# Altium schematic sheet Sheet2.SchDoc
size 420 x 297 mm; Address1: Address1; Address2: Address2; Address3: Address3; Address4: Address4; DocumentNumber: АБВГ.123456.001 Э3; SheetNumber: 1; Scale: 1:1; DocumentType: Схема электрическая принципиальная; FirstReferrence: АБВГ.123456.001
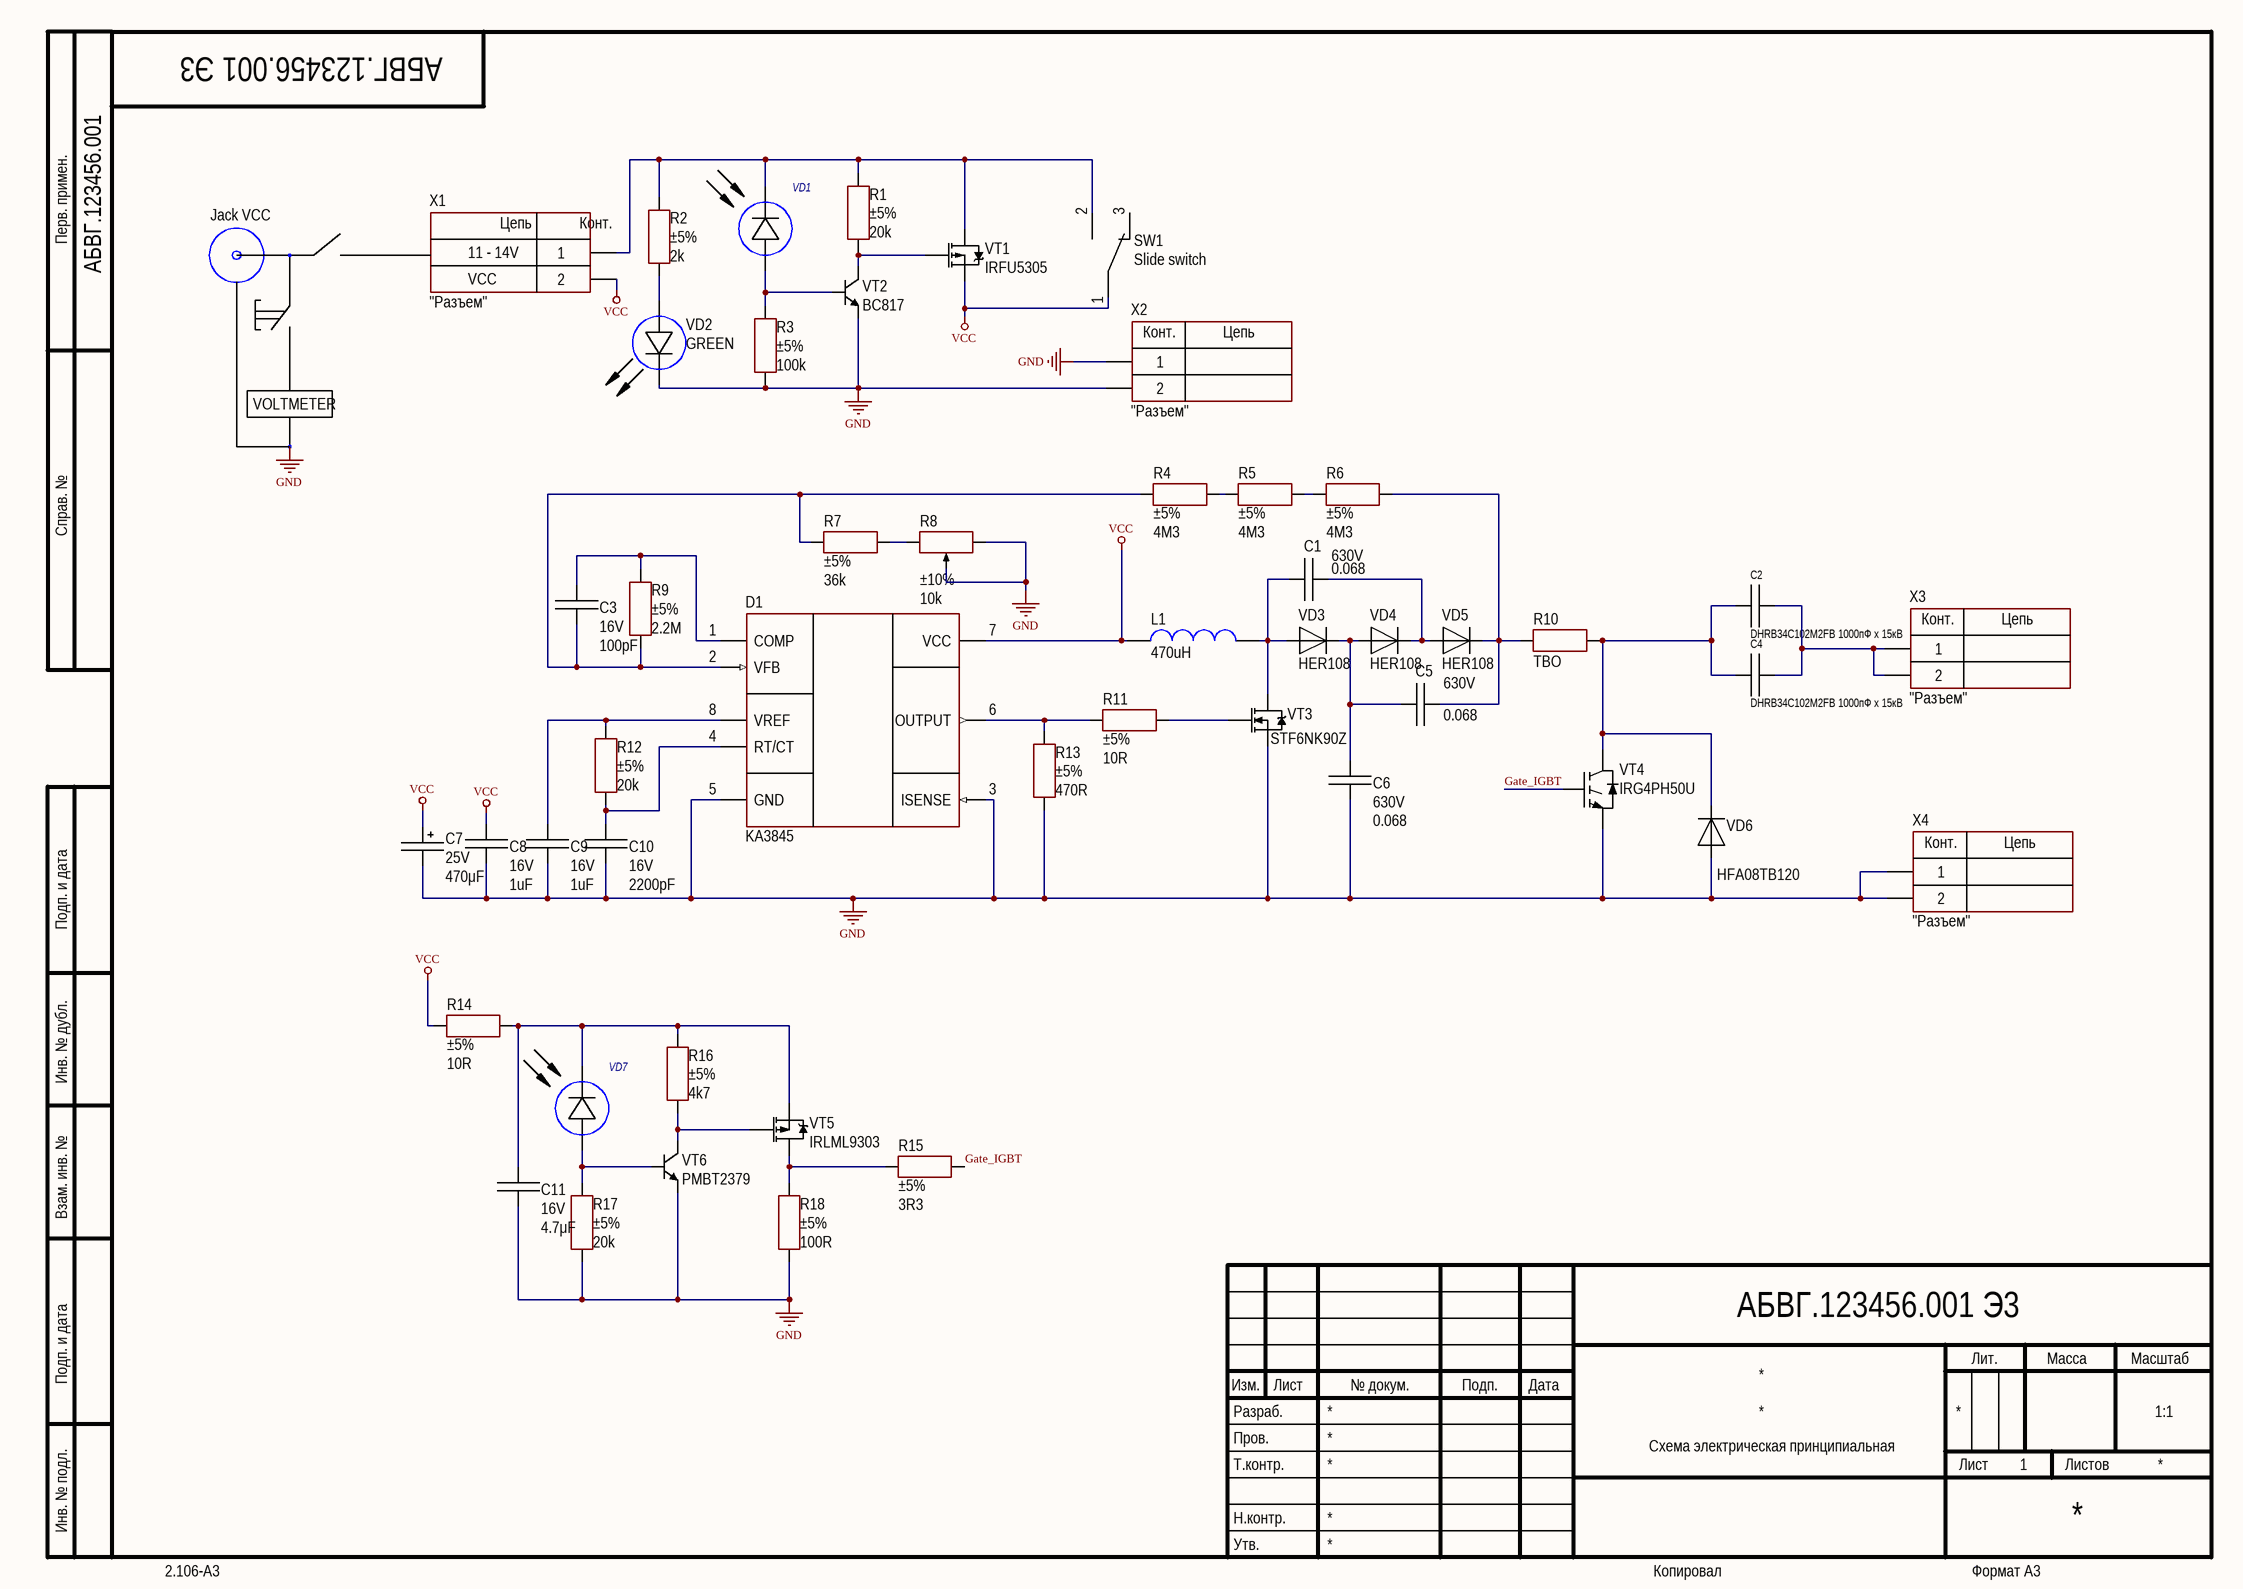
[diagram p0: Sheet2.SchDoc]

## Parts
C1  value 0.068  Voltage: 630V  [CAP: 1812]
C2  DHRB34C102M2FB 1000пФ х 15кВ  [CAP: HV_CYL_METALL-PAPER_CAP]
C3  value 100pF  Voltage: 16V  [CAP: 0805]
C4  DHRB34C102M2FB 1000пФ х 15кВ  [CAP: HV_CYL_METALL-PAPER_CAP]
C5  value 0.068  Voltage: 630V  [CAP: 1812]
C6  value 0.068  Voltage: 630V  [CAP: 1812]
C7  value 470μF  Voltage: 25V  [CAP: D8C3.5H12]
C8  value 1uF  Voltage: 16V  [CAP: 0805]
C9  value 1uF  Voltage: 16V  [CAP: 0805]
C10  value 2200pF  Voltage: 16V  [CAP: 0805]
C11  value 4.7μF  Voltage: 16V  [CAP: 0805]
D1  PartNumber: KA3845  [8-SOIC]
L1  470uH  [IND: DUMBELL 8.5x11x5]
R1  value 20k  Tolerance: ±5%  [RES: 0805]
R2  value 2k  Tolerance: ±5%  [RES: 0805]
R3  value 100k  Tolerance: ±5%  [RES: 0805]
R4  value 4M3  Tolerance: ±5%  [RES: 1206]
R5  value 4M3  Tolerance: ±5%  [RES: 1206]
R6  value 4M3  Tolerance: ±5%  [RES: 1206]
R7  value 36k  Tolerance: ±5%  [RES: 0805]
R8  value 10k  Tolerance: ±10%  [RES: 3362P]
R9  value 2.2M  Tolerance: ±5%  [RES: 0805]
R10  ТВО  [RES: ТВО 0.5]
R11  value 10R  Tolerance: ±5%  [RES: 1206]
R12  value 20k  Tolerance: ±5%  [RES: 0805]
R13  value 470R  Tolerance: ±5%  [RES: 0805]
R14  value 10R  Tolerance: ±5%  [RES: 1206]
R15  value 3R3  Tolerance: ±5%  [RES: 1206]
R16  value 4k7  Tolerance: ±5%  [RES: 0805]
R17  value 20k  Tolerance: ±5%  [RES: 0805]
R18  value 100R  Tolerance: ±5%  [RES: 0805]
SW1  Slide switch  [SW: Slide_switch 3mm between outputs]
VD1  SHF250  [LED: SFH757]  (value not drawn)
VD2  Color: GREEN  [through component 5 mm]
VD3  HER108  [DIODE: DO-41]
VD4  HER108  [DIODE: DO-41]
VD5  HER108  [DIODE: DO-41]
VD6  PartNumber: HFA08TB120  [TO220(D)]
VD7  SHF250  [LED: SFH757]  (value not drawn)
VT1  PartNumber: IRFU5305  [DPAK]
VT2  PartNumber: BC817  [SOT23]
VT3  PartNumber: STF6NK90Z  [TO-220 HV]
VT4  PartNumber: IRG4PH50U  [TO247]
VT5  PartNumber: IRLML9303  [SOT23]
VT6  PartNumber: PMBT2379  [SOT23]
X1  CommentText: "Разъем"  [CON: KF301-5.0-2P]
X2  CommentText: "Разъем"  [CON: KF301-5.0-2P]
X3  CommentText: "Разъем"  [CON: KF301-5.0-2P]
X4  CommentText: "Разъем"  [CON: KF301-5.0-2P]

## Nets
GND: C6.2 C7.2 C8.1 C9.1 C10.1 C11.1 D1.3(ISENSE) D1.5(GND) R3.1 R8.1 R8.2 R13.2 R17.2 R18.2 VD2.2(C) VD6.1 VT2.2(E) VT3.3(S) VT4.3(E) VT6.2(E) X2.1 X2.2 X4.1 X4.2
VCC: C7.1 C8.2 D1.7(VCC) L1.2 R14.1 SW1.1 VT1.2(S) X1.2
Gate_IGBT: R15.2 VT4.1(G)
NetC1_1: C1.1 VD4.2 VD5.1
NetC1_2: C1.2 L1.1 VD3.1 VT3.2(D)
NetC2_1: C2.1 C4.1 X3.1 X3.2
NetC2_2: C2.2 C4.2 R10.2 VD6.2 VT4.2(C)
NetC3_1: C3.1 D1.2(VFB) R4.1 R7.2 R9.1
NetC3_2: C3.2 D1.1(COMP) R9.2
NetC5_1: C5.1 R6.2 R10.1 VD5.2
NetC5_2: C5.2 C6.1 VD3.2 VD4.1
NetC9_2: C9.2 D1.8(VREF) R12.2
NetC10_2: C10.2 D1.4(RT/CT) R12.1
NetC11_2: C11.2 R14.2 R16.1 VD7.2(C) VT5.2(S)
NetD1_6: D1.6(OUTPUT) R11.2 R13.1
NetR1_1: R1.1 VT1.1(G) VT2.3(C)
NetR1_2: R1.2 R2.2 SW1.2 VD1.2(C) VT1.3(D) X1.1
NetR2_1: R2.1 VD2.1(A)
NetR3_2: R3.2 VD1.1(A) VT2.1(B)
NetR4_2: R4.2 R5.1
NetR5_2: R5.2 R6.1
NetR7_1: R7.1 R8.3
NetR11_1: R11.1 VT3.1(G)
NetR15_1: R15.1 R18.1 VT5.3(D)
NetR16_2: R16.2 VT5.1(G) VT6.3(C)
NetR17_1: R17.1 VD7.1(A) VT6.1(B)

Not connected (* = marked no-connect by the designer): SW1 3(4)

## Notes on the sheet
- Jack VCC
- 11 - 14V
- VCC
- VOLTMETER
- Labels drawn without touching a wire or pin: GND
- Перв. примен.
- Справ. №
- Подп. и дата
- Инв. № дубл.
- Взам. инв. №
- Разраб.
- Изм.
- Лист
- № докум.
- Подп.
- Дата
- Лит.
- Масса
- Масштаб
- Пров.
- Т.контр.
- Листов
- Инв. № подл.
- Утв.
- Н.контр.
- 2.106-A3
- Копировал
- Формат А3
- (in symbol Connector_terminal_2pin) Цепь; Конт.

## Library data of the parts
C1 C5 C6 = Ceramic_1812: Manufacturer: Yageo; PartNumber: CC1812KKX7R9BB105; ValueManufacturerPartNumber: Ceramic capacitor, 0.068, X7R, ±10%, 630V, 1812, -55...+125°C; TypeCapacitor: Ceramic capacitor; Tolerance: ±10%; TypeDielectric: X7R; Package: 1812; HelpURL: https://www.digikey.com/product-detail/en/yageo/CC1812KKX7R9BB105/311-2068-1-ND/5195970; Temperature: -55...+125°C
C2 C4 = THROUGH_HOLE_CAP
C3 = Ceramic_0805: Manufacturer: Yageo; PartNumber: CC0805KRX7R7BB104; ValueManufacturerPartNumber: Ceramic capacitor, 100pF, X7R, ±10%, 16V, 0805, -55...+125°C; TypeCapacitor: Ceramic capacitor; Tolerance: ±10%; TypeDielectric: X7R; Package: 0805; HelpURL: https://www.digikey.com/product-detail/en/yageo/CC0805KRX7R7BB104/311-1142-1-ND/303052; Temperature: -55...+125°C
C7 = Aluminium: Manufacturer: Wurth; PartNumber: 860080475013; ValueManufacturerPartNumber: Aluminium capacitor, 470μF, 25V, ±20%, 54mOhm, 14x10x5 mm, -55...+105°C; TypeCapacitor: Aluminium capacitor; Tolerance: ±20%; Impedance: 54mOhm; Package: 14x10x5 mm; HelpURL: https://www.digikey.com/product-detail/en/wurth-electronics-inc/860080475013/732-9029-1-ND/5728972; Temperature: -55...+105°C
C8 C9 = Ceramic_0805: Manufacturer: Yageo; PartNumber: CC0805KRX7R7BB104; ValueManufacturerPartNumber: Ceramic capacitor, 1uF, X7R, ±10%, 16V, 0805, -55...+125°C; TypeCapacitor: Ceramic capacitor; Tolerance: ±10%; TypeDielectric: X7R; Package: 0805; HelpURL: https://www.digikey.com/product-detail/en/yageo/CC0805KRX7R7BB104/311-1142-1-ND/303052; Temperature: -55...+125°C
C10 = Ceramic_0805: Manufacturer: Yageo; PartNumber: CC0805KRX7R7BB104; ValueManufacturerPartNumber: Ceramic capacitor, 2200pF, X7R, ±10%, 16V, 0805, -55...+125°C; TypeCapacitor: Ceramic capacitor; Tolerance: ±10%; TypeDielectric: X7R; Package: 0805; HelpURL: https://www.digikey.com/product-detail/en/yageo/CC0805KRX7R7BB104/311-1142-1-ND/303052; Temperature: -55...+125°C
C11 = Ceramic_0805: Manufacturer: Yageo; PartNumber: CC0805KRX7R7BB104; ValueManufacturerPartNumber: Ceramic capacitor, 4.7μF, X7R, ±10%, 16V, 0805, -55...+125°C; TypeCapacitor: Ceramic capacitor; Tolerance: ±10%; TypeDielectric: X7R; Package: 0805; HelpURL: https://www.digikey.com/product-detail/en/yageo/CC0805KRX7R7BB104/311-1142-1-ND/303052; Temperature: -55...+125°C
D1 = UC3842BVD1R2G: PWM controller; Manufacturer: ON Semiconductor; ValueManufacturerPartNumber: PWM controller, supply 10...30V, 500kHz, External switch, -40...+105°C, 8-SOIC; VoltageInput: supply 10...30V; Frequency: 500kHz; OutputType: External switch; HelpURL: https://www.digikey.com/product-detail/en/on-semiconductor/UC3842BVD1R2G/UC3842BVD1R2GOSCT-ND/5802572; Package: 8-SOIC; ComponentType: PWM controller; Temperature: -40...+105°C
L1 = Inductor_dumbbell
R1 R12 R17 = Resistor_0805: Manufacturer: Yageo; PartNumber: RC0805JR-07100RL; ValueManufacturerPartNumber: Resistor film, 20k, ±5%, 0805, 0.125W, -55...+125°C; TypeResistor: Resistor film; Power: 0.125W; Package: 0805; HelpURL: https://www.digikey.com/product-detail/en/yageo/RC0805JR-07100RL/311-100ARCT-ND/731185; Temperature: -55...+125°C
R2 = Resistor_0805: Manufacturer: Yageo; PartNumber: RC0805JR-07100RL; ValueManufacturerPartNumber: Resistor film, 2k, ±5%, 0805, 0.125W, -55...+125°C; TypeResistor: Resistor film; Power: 0.125W; Package: 0805; HelpURL: https://www.digikey.com/product-detail/en/yageo/RC0805JR-07100RL/311-100ARCT-ND/731185; Temperature: -55...+125°C
R3 = Resistor_0805: Manufacturer: Yageo; PartNumber: RC0805JR-07100RL; ValueManufacturerPartNumber: Resistor film, 100k, ±5%, 0805, 0.125W, -55...+125°C; TypeResistor: Resistor film; Power: 0.125W; Package: 0805; HelpURL: https://www.digikey.com/product-detail/en/yageo/RC0805JR-07100RL/311-100ARCT-ND/731185; Temperature: -55...+125°C
R4-R6 = Resistor_1206: Manufacturer: Yageo; PartNumber: RC1206JR-07100RL; ValueManufacturerPartNumber: Resistor film, 4M3, ±5%, 1206, 0.25W, -55...+125°C; TypeResistor: Resistor film; Power: 0.25W; Package: 1206; HelpURL: https://www.digikey.com/product-detail/en/yageo/RC1206JR-07100RL/311-100ERCT-ND/732153; Temperature: -55...+125°C
R7 = Resistor_0805: Manufacturer: Yageo; PartNumber: RC0805JR-07100RL; ValueManufacturerPartNumber: Resistor film, 36k, ±5%, 0805, 0.125W, -55...+125°C; TypeResistor: Resistor film; Power: 0.125W; Package: 0805; HelpURL: https://www.digikey.com/product-detail/en/yageo/RC0805JR-07100RL/311-100ARCT-ND/731185; Temperature: -55...+125°C
R8 = Trimmer: Manufacturer: Bourns; PartNumber: 3296W-1-103LF; ValueManufacturerPartNumber: Resistor film, 10k, ±10%, 3296W, 0.5W, -55...+125°C; TypeResistor: Resistor film; Power: 0.5W; Package: 3296W; HelpURL: https://www.digikey.com/product-detail/en/bourns-inc/3296W-1-103LF/3296W-103LF-ND/1088045; Temperature: -55...+125°C
R9 = Resistor_0805: Manufacturer: Yageo; PartNumber: RC0805JR-07100RL; ValueManufacturerPartNumber: Resistor film, 2.2M, ±5%, 0805, 0.125W, -55...+125°C; TypeResistor: Resistor film; Power: 0.125W; Package: 0805; HelpURL: https://www.digikey.com/product-detail/en/yageo/RC0805JR-07100RL/311-100ARCT-ND/731185; Temperature: -55...+125°C
R10 = HV RESISTOR
R11 R14 = Resistor_1206: Manufacturer: Yageo; PartNumber: RC1206JR-07100RL; ValueManufacturerPartNumber: Resistor film, 10R, ±5%, 1206, 0.25W, -55...+125°C; TypeResistor: Resistor film; Power: 0.25W; Package: 1206; HelpURL: https://www.digikey.com/product-detail/en/yageo/RC1206JR-07100RL/311-100ERCT-ND/732153; Temperature: -55...+125°C
R13 = Resistor_0805: Manufacturer: Yageo; PartNumber: RC0805JR-07100RL; ValueManufacturerPartNumber: Resistor film, 470R, ±5%, 0805, 0.125W, -55...+125°C; TypeResistor: Resistor film; Power: 0.125W; Package: 0805; HelpURL: https://www.digikey.com/product-detail/en/yageo/RC0805JR-07100RL/311-100ARCT-ND/731185; Temperature: -55...+125°C
R15 = Resistor_1206: Manufacturer: Yageo; PartNumber: RC1206JR-07100RL; ValueManufacturerPartNumber: Resistor film, 3R3, ±5%, 1206, 0.25W, -55...+125°C; TypeResistor: Resistor film; Power: 0.25W; Package: 1206; HelpURL: https://www.digikey.com/product-detail/en/yageo/RC1206JR-07100RL/311-100ERCT-ND/732153; Temperature: -55...+125°C
R16 = Resistor_0805: Manufacturer: Yageo; PartNumber: RC0805JR-07100RL; ValueManufacturerPartNumber: Resistor film, 4k7, ±5%, 0805, 0.125W, -55...+125°C; TypeResistor: Resistor film; Power: 0.125W; Package: 0805; HelpURL: https://www.digikey.com/product-detail/en/yageo/RC0805JR-07100RL/311-100ARCT-ND/731185; Temperature: -55...+125°C
R18 = Resistor_0805: Manufacturer: Yageo; PartNumber: RC0805JR-07100RL; ValueManufacturerPartNumber: Resistor film, 100R, ±5%, 0805, 0.125W, -55...+125°C; TypeResistor: Resistor film; Power: 0.125W; Package: 0805; HelpURL: https://www.digikey.com/product-detail/en/yageo/RC0805JR-07100RL/311-100ARCT-ND/731185; Temperature: -55...+125°C
SW1 = Slide_switch
VD2 = LED_single: ValueManufacturerPartNumber: LED, Green, *, *, *, -55...+150°C; TypeDiode: LED; Manufacturer: *; Package: *; HelpURL: *; Temperature: -55...+150°C; Current: *; VoltageDrop: *; PartNumber: *; ColorParameter: Green
VD3-VD5 = Through_hole_single_diode
VD6 = Diode_single: Manufacturer: Micro Commercial; ValueManufacturerPartNumber: Single diode, 75V, 150mA, 1V, 4ns, SOD-323, -55...+150°C; TypeDiode: Single diode; Voltage: 75V; Current: 150mA; VoltageDrop: 1V; RecoveryTime: 4ns; Package: SOD-323; HelpURL: https://www.digikey.com/product-detail/en/micro-commercial-co/1N4148WX-TP/1N4148WXTPMSCT-ND/717312; Temperature: -55...+150°C
VT1 VT5 = MOSFET_P_132: Manufacturer: Infineon Technologies; ValueManufacturerPartNumber: MOSFET P-channel transistor, 20V, 2.6A, 2.9nC, 2.5W, 135mOhm, 220pF, SOT-23, -55...+150°C; TypeTransistor: MOSFET P-channel transistor; VoltageDS: 20V; CurrentDS: 2.6A; RDS: 135mOhm; GateCharge: 2.9nC; InputCapacitor: 220pF; MaxPower: 2.5W; Package: SOT-23; HelpURL: https://www.digikey.com/product-detail/en/infineon-technologies/IRLML2246TRPBF/IRLML2246TRPBFCT-ND/2639576; Temperature: -55...+150°C
VT2 VT6 = BJT_NPN_132: Manufacturer: ON Semiconductor; ValueManufacturerPartNumber: NPN transistor, 45V, 100mA, 100MHz, 300mW, 0.6V, 420, SOT-23, -55...+125°C; TypeTransistor: NPN transistor; VoltageCE: 45V; CurrentCE: 100mA; VoltageSaturation: 0.6V; Frequency: 100MHz; CurrentGain: 420; MaxPower: 300mW; Package: SOT-23; HelpURL: https://www.digikey.com/product-detail/en/on-semiconductor/BC847CLT1G/BC847CLT1GOSCT-ND/917836; Temperature: -55...+125°C
VT3 = MOSFET_N_123: Manufacturer: Infineon Technologies; ValueManufacturerPartNumber: MOSFET N-channel transistor, 80V, 7A, 9.1nC, 2.5W, 34mOhm, 756pF, 8-TDSON, -55...+150°C; TypeTransistor: MOSFET N-channel transistor; VoltageDS: 80V; CurrentDS: 7A; RDS: 34mOhm; GateCharge: 9.1nC; InputCapacitor: 756pF; MaxPower: 2.5W; Package: 8-TDSON; HelpURL: https://www.digikey.com/product-detail/en/infineon-technologies/BSC340N08NS3GATMA1/BSC340N08NS3GATMA1TR-ND/2080655; Temperature: -55...+150°C
VT4 = IGBT: Manufacturer: Rohm Semiconductor; ValueManufacturerPartNumber: IGBT transistor, 650V, 40A, 40nC, 144W, 2.1V, 22ns/73ns, TO247, -55...+125°C; TypeTransistor: IGBT transistor; VoltageCE: 650V; CurrentCE: 40A; VoltageSaturation: 2.1V; GateCharge: 40nC; TimeOnOff: 22ns/73ns; MaxPower: 144W; Package: TO247; HelpURL: https://www.digikey.com/product-detail/en/rohm-semiconductor/RGTH40TS65GC11/RGTH40TS65GC11-ND/5029953; Temperature: -55...+125°C
X1-X4 = Connector_terminal_2pin: Manufacturer: Degson; ValueManufacturerPartNumber: Terminal connector, 2pin, 3.5mm, 300VAC, 10A; PartNumber: DG350-3.5-02P-14; TypeConnector: Terminal connector; VoltageMax: 300VAC; Pitch: 3.5mm; CurrentMax: 10A; Multichannel: 2pin; HelpURL: https://www.chipdip.ru/product/dg350-3.5-02p-12
VD1 VD7 = SHF250: Model: *; Manufacture: *; HelpURL: *; Case: *